# EAGLE design riffle-0.9 (EAGLE 7.2.0)
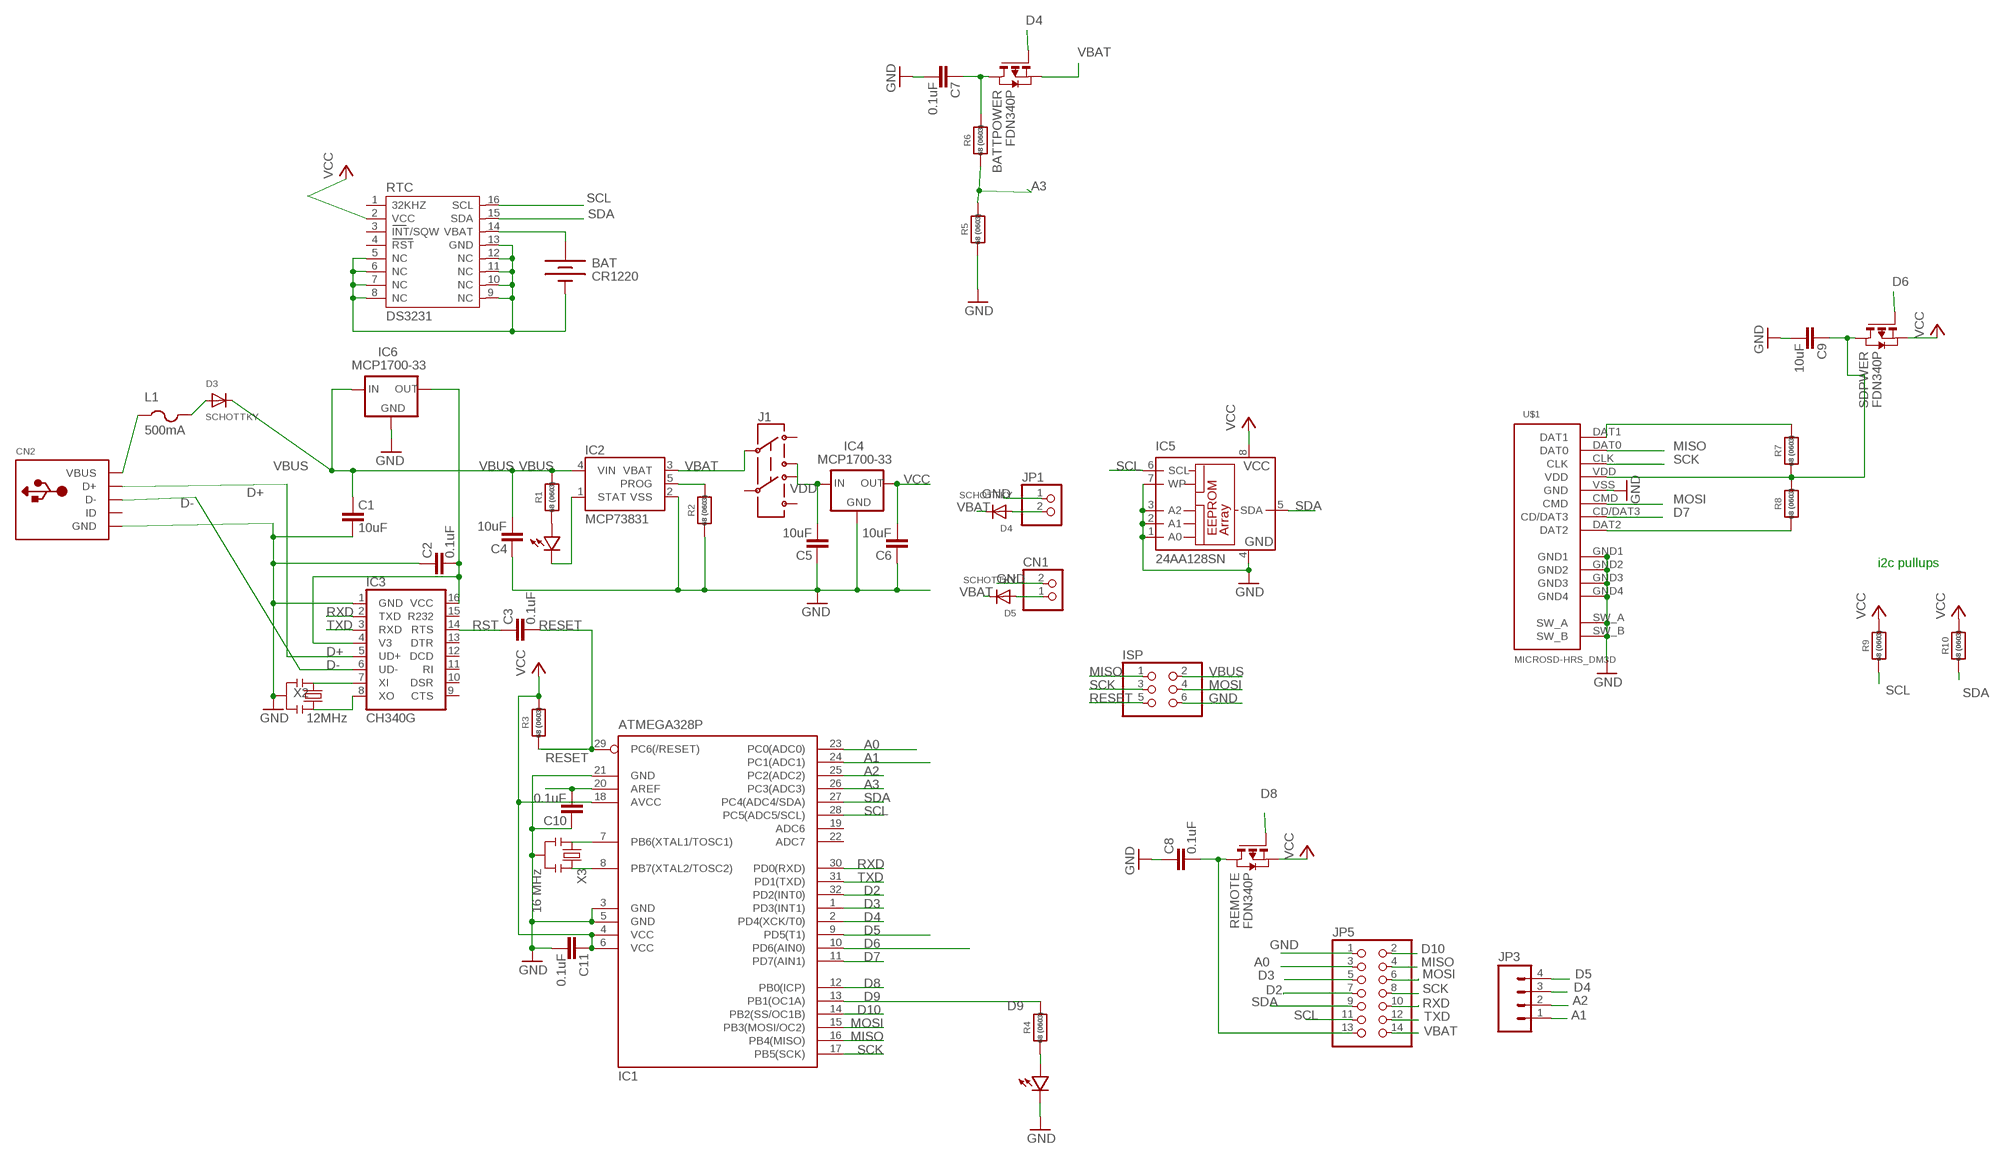
[diagram p0: schematic, sheet 1]

## Parts
BAT  CR1220  BATTERYBATTERY_12MM_SMT  [BATTCON_12MM_SMT]
BATTPOWER  FDN340P  PMOSSOT23  [SOT-23]
C1  10uF  CAP0603-CAP  [0603-CAP]
C2  0.1uF  CAP0603-CAP  [0603-CAP]
C3  0.1uF  CAP0603-CAP  [0603-CAP]
C4  10uF  CAP0603-CAP  [0603-CAP]
C5  10uF  CAP0603-CAP  [0603-CAP]
C6  10uF  CAP0603-CAP  [0603-CAP]
C7  0.1uF  CAP0603-CAP  [0603-CAP]
C8  0.1uF  CAP0603-CAP  [0603-CAP]
C9  10uF  CAP0603-CAP  [0603-CAP]
C10  0.1uF  CAP0603-CAP  [0603-CAP]
C11  0.1uF  CAP0603-CAP  [0603-CAP]
CN1  JST_2PIN-SMT-RA  [JST-PH-2-SMT-RA]
CN2  USBMICRO_20329  [4UCONN_20329]
D1  LED0603  [0603-LED]
D2  LED0603  [0603-LED]
D3  SCHOTTKY  DIODE_SOD-123FL  [SOD-123FL]
D4  SCHOTTKY  DIODE_SOD-123FL  [SOD-123FL]
D5  SCHOTTKY  DIODE_SOD-123FL  [SOD-123FL]
IC1  ATMEGA328P  MEGA8-AI  [TQFP32-08]
IC2  MCP73831  [SOT23-5]
IC3  CH340G  [SO16]
IC4  MCP1700-33  MCP1700SOT89  [SOT89]
IC5  24AA128SN  [SO-08]
IC6  MCP1700-33  MCP1700SOT89  [SOT89]
ISP  PINHD-2X3  [2X03]
J1  AYZ0202  [AYZ0202]
JP1  PINHD-1X2  [1X02]
JP3  M04SMD  [1X04-SMD]
JP5  PINHD-2X7  [2X07]
L1  500mA  PTCFUSE-1206  [R1206]
R1  68 (0603)  RESISTOR_0603_NOOUT  [0603-NO]
R2  68 (0603)  RESISTOR_0603_NOOUT  [0603-NO]
R3  68 (0603)  RESISTOR_0603_NOOUT  [0603-NO]
R4  68 (0603)  RESISTOR_0603_NOOUT  [0603-NO]
R5  68 (0603)  RESISTOR_0603_NOOUT  [0603-NO]
R6  68 (0603)  RESISTOR_0603_NOOUT  [0603-NO]
R7  68 (0603)  RESISTOR_0603_NOOUT  [0603-NO]
R8  68 (0603)  RESISTOR_0603_NOOUT  [0603-NO]
R9  68 (0603)  RESISTOR_0603_NOOUT  [0603-NO]
R10  68 (0603)  RESISTOR_0603_NOOUT  [0603-NO]
REMOTE  FDN340P  PMOSSOT23  [SOT-23]
RTC  DS3231  [DS3231]
SDPWER  FDN340P  PMOSSOT23  [SOT-23]
U$1  MICROSD-HRS_DM3D  [DM3D]
X2  12MHz  RESONATORSMD  [RESONATOR-SMD]
X3  16 MHz  RESONATORSMD  [RESONATOR-SMD]

## Nets
A0: IC1.23(PC0(ADC0)) JP5.3
A1: IC1.24(PC1(ADC1)) JP3.1
A2: IC1.25(PC2(ADC2)) JP3.2
A3: IC1.26(PC3(ADC3)) R5.2 R6.1
AREF: C10.1 IC1.20(AREF)
D2: IC1.32(PD2(INT0)) JP5.7
D3: IC1.1(PD3(INT1)) JP5.5
D4: BATTPOWER.3(G) IC1.2(PD4(XCK/T0)) JP3.3
D5: IC1.9(PD5(T1)) JP3.4
D6: IC1.10(PD6(AIN0)) SDPWER.3(G)
D7: IC1.11(PD7(AIN1)) U$1.CD/DAT3
D8: IC1.12(PB0(ICP)) REMOTE.3(G)
D9: IC1.13(PB1(OC1A)) R4.2
D10: IC1.14(PB2(SS/OC1B)) JP5.2
D+: CN2.D+ IC3.5(UD+)
D-: CN2.D- IC3.6(UD-)
GND: BAT.P$1(-) C1.1 C2.2 C4.2 C5.2 C6.2 C7.1 C8.2 C9.1 C10.2 C11.1 CN1.2 CN2.BASE@1(GND) CN2.BASE@2(GND) CN2.GND CN2.SPRT@1(GND) CN2.SPRT@2(GND) CN2.SPRT@3(GND) CN2.SPRT@4(GND) D2.MINUS IC1.3(GND) IC1.5(GND) IC1.21(GND) IC2.2(VSS) IC3.1(GND) IC4.1(GND) IC5.1(A0) IC5.2(A1) IC5.3(A2) IC5.4(GND) IC5.7(WP) IC6.1(GND) ISP.6 JP1.1 JP5.1 R2.1 R5.1 RTC.5(NC) RTC.6(NC) RTC.7(NC) RTC.8(NC) RTC.9(NC) RTC.10(NC) RTC.11(NC) RTC.12(NC) RTC.13(GND) U$1.GND1 U$1.GND2 U$1.GND3 U$1.GND4 U$1.SW_A U$1.SW_B U$1.VSS(GND) X2.2 X3.2
MISO: IC1.16(PB4(MISO)) ISP.1 JP5.4 U$1.DAT0
MOSI: IC1.15(PB3(MOSI/OC2)) ISP.4 JP5.6 U$1.CMD
N$1: D1.PLUS R1.1
N$2: IC1.7(PB6(XTAL1/TOSC1)) X3.1
N$3: IC1.8(PB7(XTAL2/TOSC2)) X3.3
N$4: C9.2 R7.1 R8.2 SDPWER.1(D) U$1.VDD
N$5: D1.MINUS IC2.1(STAT)
N$6: IC2.5(PROG) R2.2
N$7: C8.1 JP5.13 REMOTE.1(D)
N$8: C2.1 IC3.4(V3) IC3.16(VCC) IC6.3(OUT)
N$10: D3.A L1.2
N$11: IC3.7(XI) X2.1
N$12: CN1.1 D5.A
N$13: IC3.8(XO) X2.3
N$14: D4.A JP1.2
N$15: BATTPOWER.1(D) C7.2 R6.2
N$16: R7.2 U$1.DAT1
N$17: D2.PLUS R4.1
N$18: R8.1 U$1.DAT2
N$19: CN2.VBUS L1.1
RESET: C3.1 IC1.29(PC6(/RESET)) ISP.5 R3.1
RST: C3.2 IC3.14(RTS)
RTC_BATT: BAT.P$2(+) RTC.14(VBAT)
RXD: IC1.30(PD0(RXD)) IC3.2(TXD) JP5.10
SCK: IC1.17(PB5(SCK)) ISP.3 JP5.8 U$1.CLK
SCL: IC1.28(PC5(ADC5/SCL)) IC5.6(SCL) JP5.11 R9.1 RTC.16(SCL)
SDA: IC1.27(PC4(ADC4/SDA)) IC5.5(SDA) JP5.9 R10.1 RTC.15(SDA)
TXD: IC1.31(PD1(TXD)) IC3.3(RXD) JP5.12
VBAT [vcc]: BATTPOWER.2(S) D4.C D5.C IC2.3(VBAT) J1.2 JP5.14
VBUS [vcc]: C1.2 C4.1 D3.C IC2.4(VIN) IC6.2(IN) ISP.2 R1.2
VCC: C6.1 C11.2 IC1.4(VCC) IC1.6(VCC) IC1.18(AVCC) IC4.3(OUT) IC5.8(VCC) R3.2 R9.2 R10.2 REMOTE.2(S) RTC.2(VCC) SDPWER.2(S)
VDD: C5.1 IC4.2(IN) J1.1
Unconnected: CN2.ID IC1.19(ADC6) IC1.22(ADC7) IC3.9(CTS) IC3.10(DSR) IC3.11(RI) IC3.12(DCD) IC3.13(DTR) IC3.15(R232) J1.3 J1.4 J1.5 J1.6 RTC.1(32KHZ) RTC.3(INT/SQW) RTC.4(RST)

## Notes on the sheet
- i2c pullups

## Library data of the parts
BAT = SparkFunNew:BATTERY: Battery Holders Various common sizes : AA, AAA, 20mm coin cell and 12mm coin cell.
BATTPOWER REMOTE SDPWER = zetex:PMOSSOT23: MOS FET; OC_FARNELL: unknown; OC_NEWARK: unknown
C1-C11 = SparkFun:CAP: Capacitor Standard 0603 ceramic capacitor, and 0.1" leaded capacitor.
CN1 = adafruit:JST_2PIN: JST 2-Pin Connectors of various flavors SMT-RA (S2B-PH-SM4) 4UConnector #17311 SMT (B2B-PH-SM4) THM-RA (S2B-PH) THM (B2B-PH)
CN2 = microbuilder:USB: USB Connectors USBMINIB - Surface Mount Female Mini-B USB Connector 4UConnector: 06564
D1 D2 = LowPowerLab:LED
D3-D5 = adafruit:DIODE: Diode SMADIODE - SMA Surface Mount Package 20V 1A Schottky Diode Digikey: 641-1014-6-ND DO-1N4148 - Through Hole Small Current Diode SOD-123 20V 1 A (.5mV Vf) Schottky Diode - Digikey: MBRX120TPMSCT-ND SOD-323 10V 570mA (.38mV Vf, 3ns) Schottky Diode - Digikey: ZLLS410CT-ND SOD-523 30V 30mA Schottky Diode (RB751S-40TE61) - Digikey: RB751S-40TE61CT-ND SOT23-R/W - SOT23 Package (R = Solder Paste/Reflow Ovens, W = Hand-Soldering) BAT54Film 40V 300mA - Digikey: 497-7162-1-ND
IC1 = atmel:MEGA8: MICROCONTROLLER 8 Kbytes FLASH, 1 kbytes SRAM, 512 bytes EEPROM, USART, 6-channel 10 bit ADC, 2-channel 8 bit ADC Pin compatible with Atmega48, ATMega88, ATMega168 Source: avr.lbr; MPN: ATMEGA8-16AU; OC_FARNELL: 9171371; OC_NEWARK: 73M8863
IC2 = SparkFunNew:MCP73831: Microchip's MCP73831 Miniature single cell, fully integrated Li-Ion, Li-polymer charge management controller http://ww1.microchip.com/downloads/en/DeviceDoc/21984a.pdf
IC3 = SparkFunNew:CH340
IC4 IC6 = adafruit:MCP1700: VOLTAGE REGULATOR
IC5 = microchip:24*: Serial EEPROM I2C; MF: MICROCHIP; MPN: 24AA128-I/SN; OC_FARNELL: unknown; OC_NEWARK: 92C6842
ISP = pinhead:PINHD-2X3: PIN HEADER
J1 = SparkFunNew:AYZ0202: SPDT Slide Switch Simple SMD single-pull double-throw slide switch. Good for less than 350mA power switch, switching UARTs between devices, etc. Spark Fun Electronics SKU : COM-00597
JP1 = pinhead:PINHD-1X2: PIN HEADER
JP3 = SparkFun:M04: Header 4 Standard 4-pin 0.1" header. Use with straight break away headers (SKU : PRT-00116), right angle break away headers (PRT-00553), swiss pins (PRT-00743), machine pins (PRT-00117), and female headers (PRT-00115). Molex polarized connector foot print use with SKU : PRT-08231 with associated crimp pins and housings.
JP5 = pinhead:PINHD-2X7: PIN HEADER
L1 = adafruit:PTCFUSE: PTC fuses, resettable thermistors
R1-R10 = microbuilder:RESISTOR: Resistors For new designs, use the packages preceded by an '_' character since they are more reliable: The following footprints should be used on most boards: _0402 - Standard footprint for regular board layouts _0603 - Standard footprint for regular board layouts _0805 - Standard footprint for regular board layouts _1206 - Standard footprint for regular board layouts For extremely tight-pitch boards where space is at a premium, the following 'micro-pitch' footprints can be used (smaller pads, no silkscreen outline, etc.): _0402MP - Micro-pitch footprint for very dense/compact boards _0603MP - Micro-pitch footprint for very dense/compact boards _0805MP - Micro-pitch footprint for very dense/compact boards _1206MP - Micro-pitch footprint for very dense/compact boards
RTC = _lh-library:DS3231
U$1 = hrs_DM3D-SF:MICROSD-HRS_DM3D
X2 = SparkFunNew:RESONATOR: Resonator Small SMD resonator. This is the itty bitty 10/20MHz resonators with built in caps. CSTCE10M0G55 and CSTCE20M0V53. Footprint has been reviewed closely but hasn't been tested yet.
X3 = SparkFun:RESONATOR: Resonator Small SMD resonator. This is the itty bitty 10/20MHz resonators with built in caps. CSTCE10M0G55 and CSTCE20M0V53. Footprint has been reviewed closely but hasn't been tested yet.

## Board
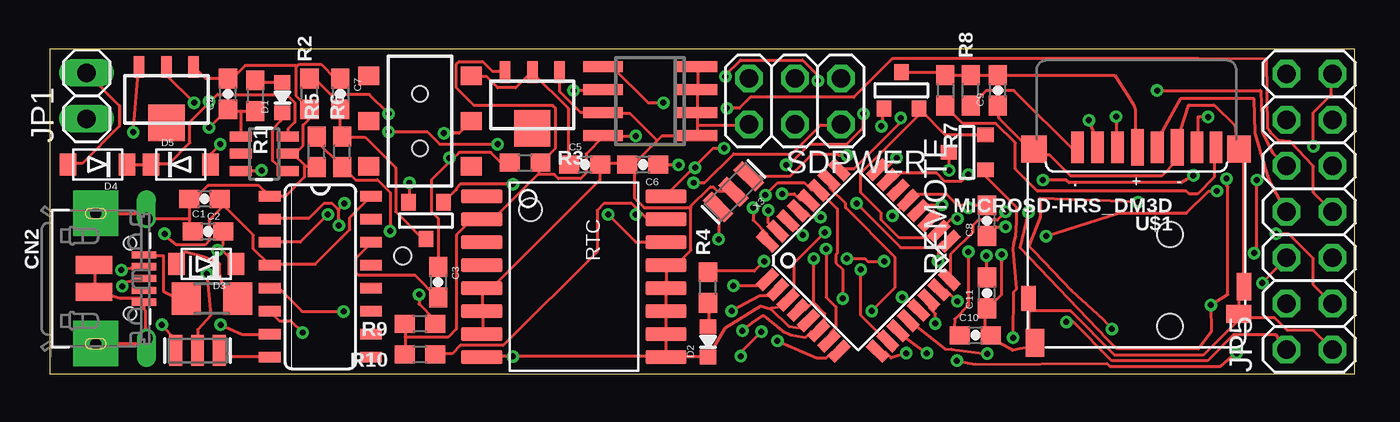
[diagram p1: board, top side]
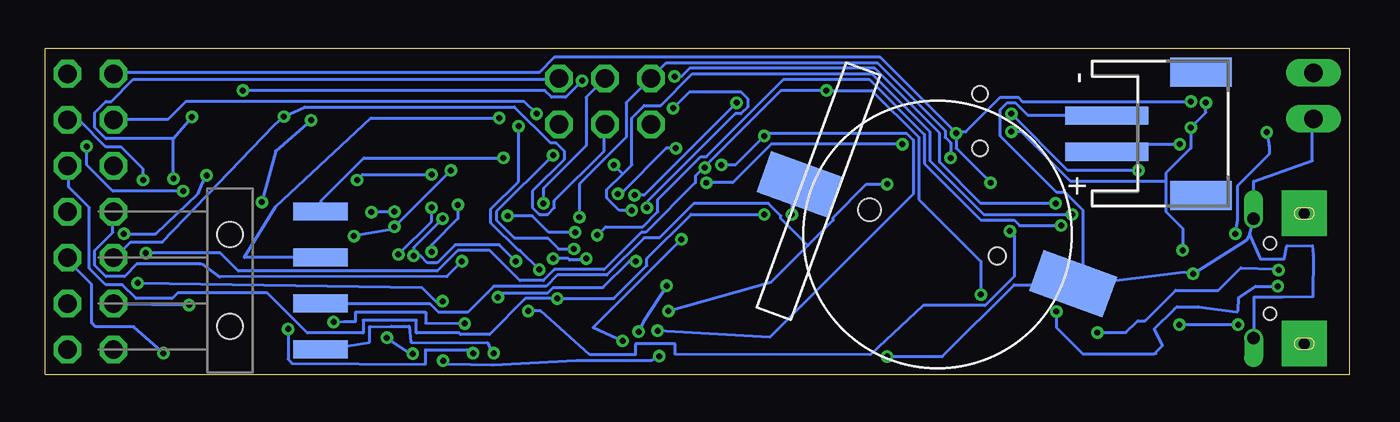
[diagram p2: board, bottom side, seen from below]

Size 72 x 18 mm. Coordinates in mm from the lower left corner, seen from the top.
Outline: 0,0 0,18 72,18 72,0 0,0
Copper layers (1*16): Top 0.0356mm / dielectric 1.5011mm / Bottom 0.0356mm
Design rules "LaenPCBOrder": minimum track width 6mil, minimum drill 13mil, track to track 6mil, track to pad 6mil, pad to pad 6mil, via to via 6mil, smd to smd 6mil, copper to edge 15mil, drill to drill 6mil, minimum pad ring 7mil, minimum via ring 7mil, stop-mask expansion 3mil, vias tented up to drill 0mil, thermal gap 10mil

### Footprints (pad centres in the part's own frame; a part is rotated, then mirrored left to right if it is on the bottom)
BATTCON_12MM_SMT = smd 2.4 x 4.3: P$1 0,11.96 | smd 2.4 x 4.2: P$2 0,-4.1 | hole 0.95: 0,7.5 | hole 1.25: 0,0
SOT-23 = smd 0.787 x 0.889: 1 0.025,-1.016; 2 -0.94,1.016; 3 0.991,1.016
0603-CAP = smd 1.1 x 1: 1 -0.85,0; 2 0.85,0
JST-PH-2-SMT-RA = smd 1 x 4.6: 1 1,-3.7; 2 -1,-3.7 | smd 1.6 x 3.4: NC1 -3.4,1.5; NC2 3.4,1.5
4UCONN_20329 = smd 1 x 2: BASE@1 -0.75,-2; BASE@2 0.75,-2 | smd 0.4 x 1.35: D+ 0,0.775; D- -0.65,0.775; GND 1.3,0.775; ID 0.65,0.775; VBUS -1.3,0.775 | drill 0.7 offset: SPRT@1 -3.3,0.9; SPRT@2 3.3,0.9 | drill 0.6 pad 2.5 square: SPRT@3 -3.6,-1.9; SPRT@4 3.6,-1.9 | hole 0.7: -1.95,0; 1.95,0
0603-LED = smd 0.8 x 0.9: MINUS -0.85,0; PLUS 0.85,0
SOD-123FL = smd 0.91 x 1.22: A 1.637,0; C -1.637,0
TQFP32-08 = smd 1.27 x 0.559: 1 -4.293,2.8; 2 -4.293,2; 3 -4.293,1.2; 4 -4.293,0.4; 5 -4.293,-0.4; 6 -4.293,-1.2; 7 -4.293,-2; 8 -4.293,-2.8; 17 4.293,-2.8; 18 4.293,-2; 19 4.293,-1.2; 20 4.293,-0.4; 21 4.293,0.4; 22 4.293,1.2; 23 4.293,2; 24 4.293,2.8 | smd 0.559 x 1.27: 9 -2.8,-4.293; 10 -2,-4.293; 11 -1.2,-4.293; 12 -0.4,-4.293; 13 0.4,-4.293; 14 1.2,-4.293; 15 2,-4.293; 16 2.8,-4.293; 25 2.8,4.293; 26 2,4.293; 27 1.2,4.293; 28 0.4,4.293; 29 -0.4,4.293; 30 -1.2,4.293; 31 -2,4.293; 32 -2.8,4.293
SOT23-5 = smd 0.55 x 1.2: 1 -0.95,-1.3; 2 0,-1.3; 3 0.95,-1.3; 4 0.95,1.3; 5 -0.95,1.3; 6 0,1.3
SO16 = smd 0.6 x 1.2: 1 -4.445,-2.8; 2 -3.175,-2.8; 3 -1.905,-2.8; 4 -0.635,-2.8; 5 0.635,-2.8; 6 1.905,-2.8; 7 3.175,-2.8; 8 4.445,-2.8; 9 4.445,2.8; 10 3.175,2.8; 11 1.905,2.8; 12 0.635,2.8; 13 -0.635,2.8; 14 -1.905,2.8; 15 -3.175,2.8; 16 -4.445,2.8
SOT89 = smd 0.58 x 1.2: 1 -1.5,-1.8; 2 0,-1.8; 3 1.5,-1.8 | smd 2 x 2: 4 0,1.3
SO-08 = smd 0.6 x 2.2: 1 -1.905,-2.6; 2 -0.635,-2.6; 3 0.635,-2.6; 4 1.905,-2.6; 5 1.905,2.6; 6 0.635,2.6; 7 -0.635,2.6; 8 -1.905,2.6
2X03 = drill 1.016 octagon: 1 -2.54,-1.27; 2 -2.54,1.27; 3 0,-1.27; 4 0,1.27; 5 2.54,-1.27; 6 2.54,1.27
AYZ0202 = smd 1 x 1.15: 1 -2.5,2.825; 2 0,2.825; 3 2.5,2.825; 4 -2.5,-2.825; 5 0,-2.825; 6 2.5,-2.825 | hole 0.85: 1.5,0; -1.5,0
1X02 = drill 1.016 long: 1 -1.27,0; 2 1.27,0
1X04-SMD = smd 1 x 3: 1 -3.81,5; 2 -1.27,5; 3 1.27,5; 4 3.81,5 | hole 1.4: -2.54,0; 2.54,0
2X07 = drill 1.016 octagon: 1 -7.62,-1.27; 2 -7.62,1.27; 3 -5.08,-1.27; 4 -5.08,1.27; 5 -2.54,-1.27; 6 -2.54,1.27; 7 0,-1.27; 8 0,1.27; 9 2.54,-1.27; 10 2.54,1.27; 11 5.08,-1.27; 12 5.08,1.27; 13 7.62,-1.27; 14 7.62,1.27
R1206 = smd 1.6 x 1.803: 1 -1.422,0; 2 1.422,0
0603-NO = smd 1.1 x 1: 1 -0.85,0; 2 0.85,0
DS3231 = smd 0.762 x 2.286: 1 -4.445,-5.08; 2 -3.175,-5.08; 3 -1.905,-5.08; 4 -0.635,-5.08; 5 0.635,-5.08; 6 1.905,-5.08; 7 3.175,-5.08; 8 4.445,-5.08; 9 4.445,5.08; 10 3.175,5.08; 11 1.905,5.08; 12 0.635,5.08; 13 -0.635,5.08; 14 -1.905,5.08; 15 -3.175,5.08; 16 -4.445,5.08
DM3D = smd 0.7 x 1.75: CD/DAT3 8.15,0.45; CLK 4.85,0.45; CMD 7.05,0.45; DAT0 2.65,0.45; DAT1 1.6,0.45; DAT2 9.25,0.45 | smd 0.8 x 1.5: GND1 0.05,8.15 | smd 0.8 x 1.4: GND2 11.95,8.8 | smd 1.4 x 1.5: GND3 11.65,0.55 | smd 1.3 x 1.5: GND4 0.35,0.55 | smd 1 x 1.55: SW_A 11.6,11.25 | smd 1.4 x 1: SW_B 0.35,9.65 | smd 0.7 x 2.032: VDD 5.95,0.45; VSS 3.75,0.45
RESONATOR-SMD = smd 0.7 x 1.7: 1 -1.2,0; 2 0,0; 3 1.2,0

### Placement (x,y rotation side)
BAT  26.5,9.1 250 bottom
BATTPOWER  20.7,8.5 0 top
C1  8.7,7.9 0 top
C2  8.5,9.7 180 top
C3  21.4,5.1 270 top
C4  9.8,15.5 90 top
C5  29.5,11.6 0 top
C6  32.7,11.6 180 top
C7  16,15.5 270 top
C8  51.7,8.5 90 top
C9  52.3,15.7 90 top
C10  51.06,2.17 0 top
C11  51.7,4.5 90 top
CN1  9.7,13.3 270 bottom
CN2  4.4,5.3 270 top
D1  12.8,15.3 90 top
D2  36.3,1.8 90 top
D3  8.6,6.1 180 top
D4  2.6,11.6 180 top
D5  7.2,11.6 0 top
IC1  44.6,6.3 45 top
IC2  11.8,12.2 90 top
IC3  14.9,5.4 270 top
IC4  26.6,14.9 180 top
IC5  33.1,15.1 90 top
IC6  6.4,15.2 180 top
ISP  41.1,15.1 180 top
J1  20.4,14 270 top
JP1  2,15.4 90 top
JP3  61.8,5.2 270 bottom
JP5  69.5,9 90 top
L1  8.9,4.18 0 top
R1  11.3,15.4 270 top
R2  14.3,15.5 90 top
R3  26.2,11.7 0 top
R4  36.3,4.8 90 top
R5  14.7,12.3 90 top
R6  16.1,12.3 90 top
R7  49.4,15.7 270 top
R8  50.8,15.7 90 top
R9  20.4,2.8 180 top
R10  20.4,1.1 180 top
REMOTE  50.6,12.3 270 top
RTC  28.9,5.4 270 top
SDPWER  47,15.7 180 top
U$1  65.95,13 180 top
X2  8.12,1.32 0 top
X3  37.7,10.1 225 top

### Tracks (layer width: path | path; a pad name or v marks a point on that pad's centre or on a via)
A0  (via drill 0.33)
  Top 0.152: v50.67,11.05 50.29,10.67 49.38,10.67 48.92,11.12 46.94,11.12 46.63,10.82 46.25,10.82 IC1.23 | v54.79,10.74 56.08,10.74 56.24,10.59 62.43,10.62 62.43,10.59 v63.09,11 | v67.67,7.77 68.35,7.77 69.72,6.4 69.72,4.95 70.71,3.96 JP5.3
  Bottom 0.152: v50.67,11.05 54.48,11.05 v54.79,10.74 | v63.09,11 63.3,10.59 63.55,10.01 65.91,7.77 v67.67,7.77
A1  (via drill 0.33)
  Top 0.152: v46.71,11.96 46.1,11.35 45.72,11.35 IC1.24
  Bottom 0.152: v46.71,11.96 54.41,11.96 56.77,9.6 56.77,9.07 JP3.1
A2  (via drill 0.33)
  Top 0.152: v46.94,14.17 46.94,13.95 44.35,11.35 43.59,11.35 IC1.25
  Bottom 0.152: v46.94,14.17 54.03,14.17 59.28,9.27 61.01,6.45 57.38,6.48 56.84,6.48 JP3.2
A3  (via drill 0.33)
  Top 0.152: R5.2 14.71,13.11 14.71,12.88 16.08,11.51 R6.1 16.15,11.43 16.84,10.74 18.06,10.74 18.75,10.06 v18.75,7.92 | v45.34,3.5 46.63,4.8 46.63,6.48 43.89,9.22 43.89,9.45 43.05,10.29 43.05,10.74 IC1.26
  Bottom 0.152: v45.34,3.5 44.65,3.5 41.94,1.09 39.42,1.09 39.42,1.68 37.24,1.68 37.24,1.12 26.47,1.09 23.55,3.81 20.12,3.81 18.52,5.41 18.52,7.7 v18.75,7.92
AREF  (via drill 0.33)
  Top 0.152: v50.67,6.78 50.67,3.81 49.91,3.05 49.86,2.16 C10.1 | v49.23,9.37 48.23,9.37 47.93,9.07 IC1.20
  Bottom 0.152: v50.67,6.78 50.67,7.16 49.23,8.61 v49.23,9.37
D2  (via drill 0.33)
  Top 0.152: v38.79,9.22 38.79,8.53 39.55,7.77 39.55,7.39 IC1.32 | v37.34,14.71 38.02,14.71 38.63,15.32 44.35,15.32 46.48,17.45 63.4,17.45 67.16,17.42 67.21,13.59 67.36,13.36 67.82,12.93 68.45,12.88 69.72,11.51 69.72,10.06 70.71,9.07 JP5.7
  Bottom 0.152: v38.79,9.22 38.79,9.53 33.91,14.4 33.6,14.4 33.22,14.78 33.22,15.24 33.6,15.62 36.42,15.62 v37.34,14.71
D3  (via drill 0.33)
  Top 0.152: IC1.1 39.24,4.9 v37.7,4.9 | v39.24,2.37 38.16,1.26 v38.11,1.01 | v50.04,0.76 51.05,0.56 58.32,0.61 58.47,0.46 64.59,0.46 65.28,1.02 v65.48,1.17
  Bottom 0.152: v37.7,4.9 38.99,2.9 v39.24,2.37 | v38.11,1.01 38.56,0.75 42.67,0.75 42.68,0.76 47.3,0.51 49.73,0.56 49.94,0.76 v50.04,0.76 | v65.48,1.17 65.58,1.27 67.11,2.64 69.24,2.64 69.44,2.85 69.44,4.98 70.77,6.3 JP5.5
D4  (via drill 0.33)
  Top 0.152: v25.53,10.52 22.63,10.52 22.4,10.29 22.4,10.21 21.72,9.53 BATTPOWER.3 | v37.6,3.5 39.17,4.34 39.78,4.34 40.08,4.65 IC1.2
  Bottom 0.152: v25.53,10.52 26.67,10.52 28.5,8.69 28.5,8.53 29.91,7.12 | 29.91,7.12 31.93,5.11 v37.6,3.5 | 29.91,7.12 31.39,8.61 31.39,8.76 32.08,9.45 36.2,9.45 38.1,7.54 38.94,7.54 41,5.49 43.74,5.49 44.35,4.88 47.24,4.88 48.69,3.43 50.29,3.43 50.75,3.89 56.77,3.89 JP3.3
D5  (via drill 0.33)
  Top 0.152: v47.24,1.17 46.41,0.91 46.1,1.22 45.72,1.22 IC1.9
  Bottom 0.152: v47.24,1.17 47.4,1.32 47.57,1.75 51.82,1.78 51.92,2.67 52.88,2.67 54.03,2.64 54.1,2.64 54.1,1.78 55.98,1.47 56.77,1.45 JP3.4
D6  (via drill 0.33)
  Top 0.152: v45.87,13.72 45.95,13.79 45.95,14.63 SDPWER.3 | v44.73,5.79 44.73,3.28 46.18,1.83 IC1.10
  Bottom 0.152: v45.87,13.72 45.87,10.67 47.4,9.14 47.4,8.38 45.87,6.86 45.8,6.86 v44.73,5.79
D7  (via drill 0.33)
  Top 0.152: v48.39,1.17 46.79,2.36 IC1.11 | v58.6,2.52 58.09,3.07 56.36,4.65 54.3,6.81 54,7.09 54.63,8.71 54.63,9.73 v60.05,9.53 | v57.33,14.05 57.99,12.5 57.76,12.27 U$1.CD/DAT3
  Bottom 0.152: v48.39,1.17 48.74,1.37 51,1.37 51,0.56 58.37,0.61 58.6,0.84 v58.6,2.52 | v60.05,9.53 59.28,12.34 v57.33,14.05
D8  (via drill 0.33)
  Top 0.152: v53.14,2.03 53.19,4.57 53.34,4.72 53.14,6.91 53.19,7.21 53.29,7.62 53.34,8.46 53.34,9.22 51.66,10.9 51.66,11.28 REMOTE.3 | v51.71,1.14 49.73,1.4 49.38,1.42 47.4,2.97 IC1.12
  Bottom 0.152: v53.14,2.03 51.89,1.17 v51.71,1.14
D9  (via drill 0.33)
  Top 0.152: v39.4,6.25 38.86,5.71 36.35,5.71 R4.2 | v47.02,4.27 47.17,4.27 47.85,3.58 IC1.13
  Bottom 0.152: v39.4,6.25 39.78,6.25 41.22,4.8 43.97,4.8 44.27,4.5 46.79,4.5 v47.02,4.27
D10  (via drill 0.33)
  Top 0.152: v48.84,2.82 48.84,3.35 48.54,3.66 48.54,4.04 IC1.14 | v56.08,2.9 56.46,2.9 58.6,0.76 63.88,0.76 65.3,2.18 67.67,2.18 68.2,1.37 JP5.2
  Bottom 0.152: v48.84,2.82 51,2.85 51,3.45 54.86,3.45 54.86,2.92 55.5,2.92 v56.08,2.9
D+  (via drill 0.33)
  Top 0.152: IC3.5 12.04,4.83 12.57,4.8 13.89,3.48 v16.18,3.48 | v3.96,4.88 3.98,5.1 CN2.D+
  Bottom 0.152: v16.18,3.48 16.18,2.59 14.73,1.14 10.77,1.14 | 10.69,1.14 10.77,1.14 | 10.77,1.14 10.31,1.6 10.77,2.52 9.65,3.63 9.53,3.73 8.33,3.73 6.22,3.45 6.15,3.53 6.12,4.24 5.18,4.88 v3.96,4.88
D-  (via drill 0.33)
  Top 0.152: IC3.6 12.62,2.97 13.26,2.97 v13.92,2.31 | v3.91,5.77 4.56,5.92 CN2.D-
  Bottom 0.152: v13.92,2.31 12.34,2.31 11.68,2.97 11.28,2.97 9.6,4.65 7.24,4.65 5.99,5.89 4.09,5.82 v3.91,5.77
GND  (via drill 0.33)
  Top 0.152: 50.67,9.37 50.06,9.37 49.45,9.98 47.7,9.98 47.4,9.68 IC1.21 47.32,9.6 v46.48,8.76 | 50.67,9.37 51.66,9.37 C8.2 | 54.03,3.5 54.03,1.75 54.25,1.52 U$1.SW_A 54.18,1.52 53.52,1.42 53.11,1.32 53.09,1.35 51.66,2.11 C10.2 51.59,2.26 51.59,3.5 51.66,3.58 C11.1 51.74,3.66 52.5,4.42 v52.5,6.63 | 54.03,3.5 54.03,3.89 U$1.GND2 54.03,3.5 | v50.67,9.22 50.67,9.37 | U$1.SW_B 65.61,3.12 65.61,4.27 65.84,4.5 U$1.GND1 65.84,4.57 65.84,11.89 65.61,12.12 U$1.GND4 65.53,12.19 65.38,13.79 64.24,14.88 62.84,14.88 62.18,12.8 62.18,12.27 U$1.VSS 62.1,12.19 62.1,11.73 61.34,10.97 56.31,10.97 55.17,12.12 54.25,12.12 U$1.GND3 54.18,12.19 54.18,12.34 52.35,14.17 52.35,14.78 C9.1 | U$1.SW_B 65.68,3.12 67.59,3.12 68.28,2.44 69.72,2.44 70.71,1.45 JP5.1 | 54.03,3.5 56.31,3.5 58.75,1.07 63.63,1.07 65.53,2.97 U$1.SW_B | 7.7,8.61 7.7,8.08 7.85,7.92 C1.1 | 7.7,8.61 7.7,9.68 C2.2 7.77,9.68 7.92,9.68 8.69,10.44 11.51,10.44 12.04,9.91 IC3.1 | 7.7,8.61 5.33,8.61 CN2.SPRT@1 5,8.9 CN2.SPRT@3 | IC6.1 7.92,16.99 8.53,16.38 9.75,16.38 C4.2 9.83,16.38 10.06,16.38 10.74,17.07 13.56,17.07 13.6,17.03 | 12.12,9.83 IC3.1 | 14.06,11.54 13.41,12.19 IC2.2 13.49,12.19 13.95,12.65 13.95,13.79 14.25,14.1 14.25,14.63 R2.1 14.25,14.71 13.56,15.39 13.56,16.99 13.6,17.03 | 14.06,11.54 14.1,11.51 14.63,11.51 R5.1 | 13.6,17.03 13.72,17.14 14.94,17.14 15.7,16.38 15.93,16.38 C7.1 | IC3.1 12.19,9.83 12.95,9.83 14.02,10.9 14.02,11.51 14.06,11.54 | CN2.BASE@1 2.44,6.02 2.44,4.57 CN2.BASE@2 2.52,4.57 3.83,4.19 4.95,4.19 5.11,4.04 CN2.GND 5.18,3.96 5.18,3.58 5.26,3.5 5.26,2.59 | 5.26,2.59 CN2.SPRT@2
  Top 0.152: v8.64,5.56 8.84,3.25 8.13,2.46 X2.2 | 35.36,9.22 35.36,6.86 34.59,6.1 33.98,6.1 RTC.13 33.98,6.02 33.98,4.8 RTC.12 33.98,4.72 RTC.11 33.98,3.43 33.98,2.29 RTC.10 33.98,2.21 33.98,1.07 RTC.9 | 35.36,9.22 35.36,9.3 36.42,10.36 36.58,10.36 36.8,10.13 37.64,10.13 X3.2 | 39.76,3.62 39.78,3.66 40.39,3.73 40.69,4.04 IC1.3 40.77,4.12 41.07,4.42 41.07,6.17 v42.75,7.85 | 39.76,3.62 40.77,2.67 41.4,2.56 41.83,2.97 IC1.5 | RTC.9 33.98,0.99 36.27,0.99 D2.MINUS 36.35,0.99 37.26,2.56 39.22,3.79 39.76,3.62 | RTC.8 23.85,0.99 v25.53,0.99 33.91,0.99 RTC.9 | IC4.1 28.12,16.69 28.12,15.62 29.26,14.48 30.48,14.48 IC5.7 30.56,14.4 32,14.4 33.49,12.92 | RTC.7 23.85,2.29 23.85,3.43 RTC.6 23.85,3.5 23.85,4.72 RTC.5 23.93,4.72 24.31,4.72 30.33,10.74 30.33,11.58 C5.2 30.4,11.66 31.77,11.66 C6.2 | IC5.4 35.74,16.99 35.74,15.77 IC5.3 35.74,15.7 35.74,14.48 IC5.2 35.74,14.4 35.74,13.79 | 33.49,12.92 33.76,13.18 35.66,13.18 IC5.1 35.74,13.26 35.74,13.79 | 33.49,12.92 32.16,11.58 31.93,11.58 C6.2 | 35.74,13.79 38.56,13.79 ISP.6 | 35.36,9.22 32.77,9.22 32.23,9.75 32.23,11.58 C6.2 | 5.26,2.59 4.9,1.7 CN2.SPRT@4
  Bottom 0.152: v50.67,9.22 50.67,8.46 v52.5,6.63 | JP1.1 2.06,14.1 2.06,11.81 5.31,10.67 CN2.SPRT@1 5.33,8.53 5.44,8.03 5.5,7.76 | 5.5,7.76 4.9,6.38 3.61,6.38 3.45,7.11 2.06,7.12 2.01,6.58 2.02,4.29 3.69,4.27 5.28,4.27 CN2.SPRT@2 | 5.5,7.76 5.71,7.42 v8.64,5.56 9.14,5.64 14.71,4.95 | 14.71,4.95 15.24,4.95 BAT.P$1 | 14.71,4.95 14.71,9.07 15.7,10.06 16.15,10.06 19.28,13.18 19.28,14.63 18.9,15.01 18.44,15.01 17.75,14.33 13.41,14.33 CN1.2 | 14.71,4.95 BAT.P$1 | v25.53,0.99 22.48,0.99 18.52,4.95 15.32,4.95 BAT.P$1 | v46.48,8.76 45.11,8.76 44.2,7.85 v42.75,7.85
MISO  (via drill 0.33)
  Top 0.152: v52.73,8.99 52.27,8.53 51.21,8.53 50.9,8.23 50.9,7.85 49.68,6.63 49.68,5.26 IC1.16 | v54,8.97 53.54,6.99 58.37,1.91 58.67,1.6 58.93,1.42 63.37,1.4 64.08,2.36 v64.06,3.83 65,4.42 65,10.36 64.92,10.44 v64.92,10.82 | v63.91,14.22 63.35,14.22 63.32,12.88 63.32,12.27 U$1.DAT0
  Bottom 0.152: v52.73,8.99 53.57,8.99 v54,8.97 | v64.06,3.83 68.2,3.89 JP5.4 | v64.92,10.82 64.92,13.03 | 64.92,13.03 v63.91,14.22 | 64.92,13.03 68.66,13.03 69.27,13.64 69.27,14.48 68.66,15.09 68.35,15.09 67.13,16.31 43.66,16.31 ISP.1
MOSI  (via drill 0.33)
  Top 0.152: v50.06,4.04 49.45,4.65 49.07,4.65 IC1.15 | v66.9,5.05 68.2,6.4 JP5.6 | v58.83,14.25 58.83,12.27 U$1.CMD
  Bottom 0.152: v50.06,4.04 50.44,4.04 51.21,4.8 v66.9,5.05 | JP5.6 68.2,6.4 67.28,7.32 65.53,7.32 59.36,13.79 v58.83,14.25 57.68,14.78 46.1,14.78 44.12,12.8 43.81,12.8 43.36,12.34 43.36,11.89 45.11,10.13 45.11,9.22 44.73,8.84 44.27,8.84 43.89,9.22 43.89,9.6 41.15,12.34 41.15,13.79 ISP.4
N$1
  Top 0.152: D1.PLUS 12.72,16.15 11.43,16.15 11.35,16.23 R1.1
N$2  (via drill 0.33)
  Top 0.152: v42.82,6.93 42.82,4.27 43.36,3.73 43.36,2.59 43.05,2.29 43.05,1.91 IC1.7 | v43.97,12.12 43.51,12.12 43.43,12.19 42.06,12.19 40.84,10.97 38.56,10.97 X3.1
  Bottom 0.152: v42.82,6.93 43.66,6.93 44.27,7.54 46.1,7.54 47.09,8.53 47.09,8.99 v43.97,12.12
N$3  (via drill 0.33)
  Top 0.152: v40.13,1.85 42.29,0.91 42.82,0.91 43.13,1.22 43.51,1.22 IC1.8 | v36.88,7.47 36.88,9.22 X3.3
  Bottom 0.152: v40.13,1.85 41.76,2.59 v36.88,7.47
N$4
  Top 0.152: SDPWER.1 47.02,16.69 49.3,16.69 49.38,16.61 R7.1 49.45,16.54 50.75,16.54 R8.2 50.83,16.54 52.27,16.54 C9.2 52.35,16.54 58.75,16.54 59.49,15.39 59.79,14.88 59.89,14.63 59.89,12.27 U$1.VDD
N$5
  Top 0.152: D1.MINUS 12.72,14.4 12.72,14.02 12.27,13.56 12.27,11.81 12.8,11.28 13.03,11.28 IC2.1
N$6  (via drill 0.33)
  Top 0.152: v18.67,14.4 17.6,15.47 15.47,15.47 14.63,16.31 14.33,16.31 R2.2 | v11.66,11.28 10.52,11.28 IC2.5
  Bottom 0.152: v18.67,14.4 15.54,11.28 v11.66,11.28
N$7  (via drill 0.33)
  Top 0.152: v49.61,11.28 49.61,12.27 REMOTE.1 | v52.73,8.15 52.2,8.15 51.74,7.7 C8.1 | v69.72,12.6 69.72,14.48 70.71,15.47 70.71,16.61 JP5.13 | v64.39,10.13 63.93,10.13 62.71,8.91 58.98,8.91 v54.97,7.64
  Bottom 0.152: v49.61,11.28 v52.73,8.15 52.88,8 v54.97,7.64 | v69.72,12.6 69.72,11.58 68.28,10.13 v64.39,10.13
N$8  (via drill 0.33)
  Top 0.152: v4.57,13.39 4.88,16.99 IC6.3 | v6.3,7.77 6.53,7.52 6.96,7.16 8.53,7.16 8.76,7.39 8.76,8.53 9.53,9.3 C2.1 9.37,9.68 9.37,9.53 11.2,7.7 11.2,6.93 12.04,6.1 IC3.4 12.12,6.1 14.63,6.1 16.54,8 16.54,8.69 17.68,9.83 IC3.16
  Bottom 0.152: v6.3,7.77 6.17,8.53 6.17,10.44 4.42,12.19 4.45,12.62 v4.57,13.39
N$10
  Top 0.152: D3.A 7.42,6.76 8.46,6.5 9.35,6.1 9.35,5.51 9.68,4.55 L1.2
N$11  (via drill 0.33)
  Top 0.152: v9.4,2.74 10.59,2.21 12.04,2.21 IC3.7 | v6.15,2.74 6.66,2.16 7.16,1.45 X2.1
  Bottom 0.152: v6.15,2.74 v9.4,2.74
N$12  (via drill 0.33)
  Top 0.152: v9.37,12.72 8.84,12.19 8.84,11.66 D5.A
  Bottom 0.152: v9.37,12.72 12.95,12.72 13.34,12.34 CN1.1
N$13
  Top 0.152: IC3.8 12.04,0.99 9.98,0.99 9.6,1.37 X2.3
N$14
  Top 0.152: D4.A 0.99,11.66 1.75,11.66 3.81,13.72 3.81,14.86 2.06,16.61 JP1.2
N$15
  Top 0.152: BATTPOWER.1 20.65,7.54 20.5,7.54 19.05,8.99 19.05,11.43 17.37,13.11 16.15,13.11 R6.2 16.08,13.18 16,13.26 16,14.63 C7.2
N$16
  Top 0.152: R7.2 49.45,14.78 50.37,13.87 52.2,13.87 53.26,12.8 53.26,11.35 54.48,10.13 62.71,10.13 62.87,9.98 63.32,9.98 64.24,10.9 64.24,12.19 U$1.DAT1
N$17
  Top 0.152: D2.PLUS 36.35,2.67 36.35,3.89 R4.1
N$18
  Top 0.152: R8.1 50.83,14.86 51.66,15.7 53.19,15.7 56.62,12.27 U$1.DAT2
N$19
  Top 0.152: CN2.VBUS 5.18,6.55 6.25,6.55 6.25,4.57 6.81,4.29 L1.1
RESET  (via drill 0.33)
  Top 0.152: 22.14,11.85 22.55,12.27 24.31,12.27 24.84,11.73 25.3,11.73 R3.1 | 22.14,11.85 21.03,10.74 21.03,8.99 21.41,8.61 21.41,6.02 C3.1 | v42.52,8.69 41.99,8.69 41.68,8.99 41.3,8.99 IC1.29 | v22.02,11.96 22.14,11.85
  Bottom 0.152: v42.52,8.69 42.52,10.52 39.93,13.11 39.93,15.01 38.63,16.31 ISP.5 38.56,16.38 37.72,17.22 26.06,17.22 22.33,13.49 22.33,13.11 22.02,12.8 v22.02,11.96
RST
  Top 0.152: C3.2 21.34,4.27 20.12,5.49 16.99,5.49 16.84,5.64 16.84,6.4 17.68,7.24 IC3.14
RTC_BATT  (via drill 0.33)
  Top 0.152: v30.79,8.84 32.31,7.32 33.91,7.32 RTC.14
  Bottom 0.152: v30.79,8.84 30.79,10.06 30.4,10.44 BAT.P$2
RXD  (via drill 0.33)
  Top 0.152: 15.89,9.11 15.93,9.07 v15.93,8.23 | 15.89,9.11 15.54,9.45 15.09,9.45 14.25,8.61 12.12,8.61 IC3.2 | v41.53,7.7 40.77,8.46 IC1.30 | v61.09,15.7 66.8,15.7 66.9,13.36 67.49,12.24 68.2,11.58 JP5.10 | v42.37,16.23 42.37,16.54 41.53,17.37 38.1,17.37 37.26,16.54 v37.26,16.46 | 15.89,9.11 v16.23,9.45
  Bottom 0.152: v15.93,8.23 18.21,8.23 18.52,8.53 20.34,8.53 23.47,11.66 23.47,13.26 26.52,16.31 31.24,16.31 35.51,12.04 35.81,12.04 38.18,9.68 38.18,8.99 39.01,8.15 41.07,8.15 v41.53,7.7 | v61.09,15.7 44.42,15.7 44.04,15.32 43.28,15.32 v42.37,16.23 | v37.26,16.46 36.88,16.46 36.42,16.92 26.21,16.92 22.63,13.34 22.63,11.73 20.34,9.45 v16.23,9.45
SCK  (via drill 0.33)
  Top 0.152: U$1.CLK 61.11,12.27 61.11,12.95 62.38,15.24 66.45,15.24 66.5,13.34 67.21,11 67.36,10.57 68.2,9.07 JP5.8 | 48.96,7.05 48.92,7.01 46.94,7.01 v44.5,9.45 | 48.96,7.05 49.23,7.32 49.61,7.32 IC1.17 | v49,6.25 49,7.01 48.96,7.05
  Bottom 0.152: v44.5,9.45 44.5,10.29 42.14,12.65 42.14,15.32 41.15,16.31 ISP.3 | v49,6.25 49.84,5.41 62.38,5.38 63.25,6.04 63.45,6.1 66.95,6.1 67.61,5.41 68.66,5.41 69.27,6.02 69.27,6.86 68.28,7.85 68.28,8.99 JP5.8
SCL  (via drill 0.33)
  Top 0.152: v40.39,9.98 41.07,9.98 41.38,9.68 41.83,9.68 IC1.28 | v37.19,12.5 36.58,12.5 35.55,11.47 | 35.55,11.47 33.98,9.91 RTC.16 | v20.34,4.42 20.34,3.89 21.18,3.05 21.18,2.82 R9.1 | v28.88,15.7 30.48,15.7 IC5.6 | v66.6,10.74 66.6,6.86 v66.45,6.71 | v35.59,11.43 35.55,11.47
  Bottom 0.152: v40.39,9.98 40.23,9.98 37.72,12.5 v37.19,12.5 | v20.34,4.42 20.34,6.25 23.77,9.68 23.77,13.11 26.36,15.7 v28.88,15.7 31.39,15.7 35.62,11.47 | v66.6,10.74 66.6,11.35 67.82,12.57 68.66,12.57 70.1,14.02 70.71,14.02 JP5.11 | v66.45,6.71 62.33,6.71 61.34,5.71 50.37,5.71 49.23,6.86 47.47,6.86 45.8,5.18 44.5,5.18 43.89,5.79 41.15,5.79 39.09,7.85 38.86,7.85 36.12,10.59 36.12,10.97 35.62,11.47 | v35.59,11.43 35.62,11.47
SDA  (via drill 0.33)
  Top 0.152: 32.5,9.03 32.92,8.61 33.91,8.61 RTC.15 | 32.5,9.03 32.08,9.45 30.56,9.45 30.18,9.07 30.18,6.78 24.99,1.6 22.63,1.6 22.17,1.14 21.26,1.14 R10.1 | v39.47,9.91 40.16,10.59 41.6,10.59 41.99,10.21 42.37,10.21 IC1.27 42.44,10.13 43.43,9.14 43.43,6.71 43.36,6.63 43.36,6.17 43.74,5.79 v43.74,4.19 | v33.83,15.01 32.99,15.01 31.01,16.99 30.56,16.99 IC5.5 | v32.31,8.84 32.5,9.03
  Bottom 0.152: v39.47,9.91 38.94,9.91 v33.83,15.01 | JP5.9 70.71,11.51 70.71,10.36 69.57,9.22 69.57,5.87 68.66,4.95 67.74,4.95 66.98,4.19 65,4.19 64.69,4.5 59.74,4.5 57.53,2.29 54.46,2.29 54.46,3 51.51,3 51.51,2.29 49.15,2.29 49.07,2.21 47.47,2.21 45.49,4.19 v43.74,4.19 40.62,4.19 38.79,6.02 38.79,6.4 36.35,8.84 v32.31,8.84
TXD  (via drill 0.33)
  Top 0.152: v15.32,8.84 13.79,7.32 12.12,7.32 IC3.3 | v39.62,9.07 39.62,8.38 40.08,7.92 IC1.31 | v44.88,14.4 44.88,13.64 43.97,12.72 41.91,12.72 40.77,11.58 v40.62,11.58
  Bottom 0.152: v15.32,8.84 20.19,8.84 23.16,11.81 23.16,13.41 26.36,16.61 36.27,16.61 38.02,14.86 38.94,14.86 39.62,14.17 39.62,11.58 40.12,11.09 | 40.12,11.09 41,10.21 41,9.75 40.31,9.07 v39.62,9.07 | v44.88,14.4 45.57,15.09 64.24,15.09 65.23,14.1 68.2,14.1 JP5.12 | 40.12,11.09 v40.62,11.58
VBAT  (via drill 0.33)
  Top 0.152: 8.8,15.05 7.7,13.95 7.7,12.8 6.55,11.66 5.56,11.66 D5.C 5.49,11.58 4.27,11.58 D4.C | 8.8,15.05 9.22,15.47 13.03,15.47 13.49,15.01 13.49,13.95 13.11,13.56 13.11,13.18 IC2.3 | v19.81,10.59 19.81,9.53 BATTPOWER.2 | v21.72,13.34 22.55,13.34 23.16,13.95 J1.2 | v8.76,15.09 8.8,15.05
  Bottom 0.152: v19.81,10.59 21.72,12.5 v21.72,13.34 | v21.72,13.34 25.91,17.53 43.89,17.53 44.73,16.69 68.2,16.69 JP5.14 | v8.76,15.09 18.06,15.09 18.29,15.32 19.28,15.32 21.18,13.41 21.72,13.41 v21.72,13.34
VBUS  (via drill 0.33)
  Top 0.152: v8.76,13.64 9.75,14.63 C4.1 9.75,14.55 10.52,14.55 | C1.2 9.53,7.85 9.53,7.16 v9.22,6.86 9.48,6.86 D3.C | 10.52,14.55 11.28,14.55 R1.2 | 10.52,14.55 10.52,13.18 IC2.4 | v7.92,15.01 6.4,16.54 IC6.2 | v35.51,10.59 36.12,10.59 37.72,12.19 40.92,12.19 42.52,13.79 43.59,13.79 ISP.2 | v24.69,12.72 21.49,12.72 20.8,13.41 v18.67,13.41
  Bottom 0.152: v9.22,6.86 9.22,8.08 10.13,8.99 10.13,10.67 | 10.13,10.67 10.13,11.12 8.76,12.5 v8.76,13.64 7.92,14.48 v7.92,15.01 | v35.51,10.59 34.06,10.59 31.93,12.72 v24.69,12.72 | v18.67,13.41 18.14,13.41 15.39,10.67 10.13,10.67
VCC  (via drill 0.33)
  Top 0.152: 19.58,2.06 19.58,2.74 R9.2 | 19.58,2.06 19.58,1.14 R10.2 | 26.94,11.09 24.46,8.61 23.85,8.61 RTC.2 23.77,8.53 23.24,8.53 22.4,7.7 22.4,2.52 21.95,2.06 19.58,2.06 | 26.94,11.09 26.98,11.12 26.98,11.66 R3.2 27.05,11.66 27.89,12.5 27.89,14.71 27.74,14.86 23.39,14.86 22.4,15.85 22.4,17.14 22.55,17.3 23.85,17.3 24.38,16.76 25.07,16.76 IC4.3 | REMOTE.2 51.59,13.26 49.38,13.26 48.01,14.63 SDPWER.2 48.08,14.48 44.73,11.12 44.73,10.06 45.87,8.91 45.87,8.53 46.86,7.54 48.69,7.54 49,7.85 IC1.18 49.07,7.92 49.76,8.61 v50.06,8.61 | v51.66,6.55 51.66,5.41 C11.2 | 42.14,3.89 42.22,3.89 42.75,3.35 42.75,2.74 42.44,2.44 IC1.6 42.37,2.36 41.99,2.36 41.68,2.06 40.86,2.19 40.4,2.4 39.34,3.26 38.75,2.86 v38.2,2.41 | 42.14,3.89 41.99,3.89 41.68,3.58 41.3,3.58 IC1.4 | v34.67,11.58 33.6,11.58 C6.1 | v32.31,13.18 30.56,13.18 IC5.8 | 30.48,13.18 IC5.8 | v46.02,6.25 45.11,6.25 44.96,6.4 v43.97,6.4 | 42.14,3.89 v42.14,6.4 | 26.94,11.09 26.98,11.05 27.81,11.05 28.04,10.82 29.26,10.82 29.57,11.12 29.57,12.19 30.48,13.11 IC5.8
  Bottom 0.152: v50.06,8.61 51.66,7.01 v51.66,6.55 51.28,6.55 50.9,6.17 50.37,6.17 49.38,7.16 46.94,7.16 v46.02,6.25 | v34.67,11.58 33.91,11.58 v32.31,13.18 32.16,13.34 24.46,13.34 24.08,12.95 24.08,9.98 32,2.06 v38.2,2.41 | v43.97,6.4 43.13,6.4 43.05,6.33 42.22,6.33 v42.14,6.4
VDD
  Top 0.152: C5.1 28.57,11.66 28.57,14.71 26.59,16.69 IC4.2 26.52,16.69 25.68,15.85 24.69,15.85 24.08,16.46 23.24,16.46 J1.1